# EAGLE design MoleGraph_shield-v1 (EAGLE 4.15)
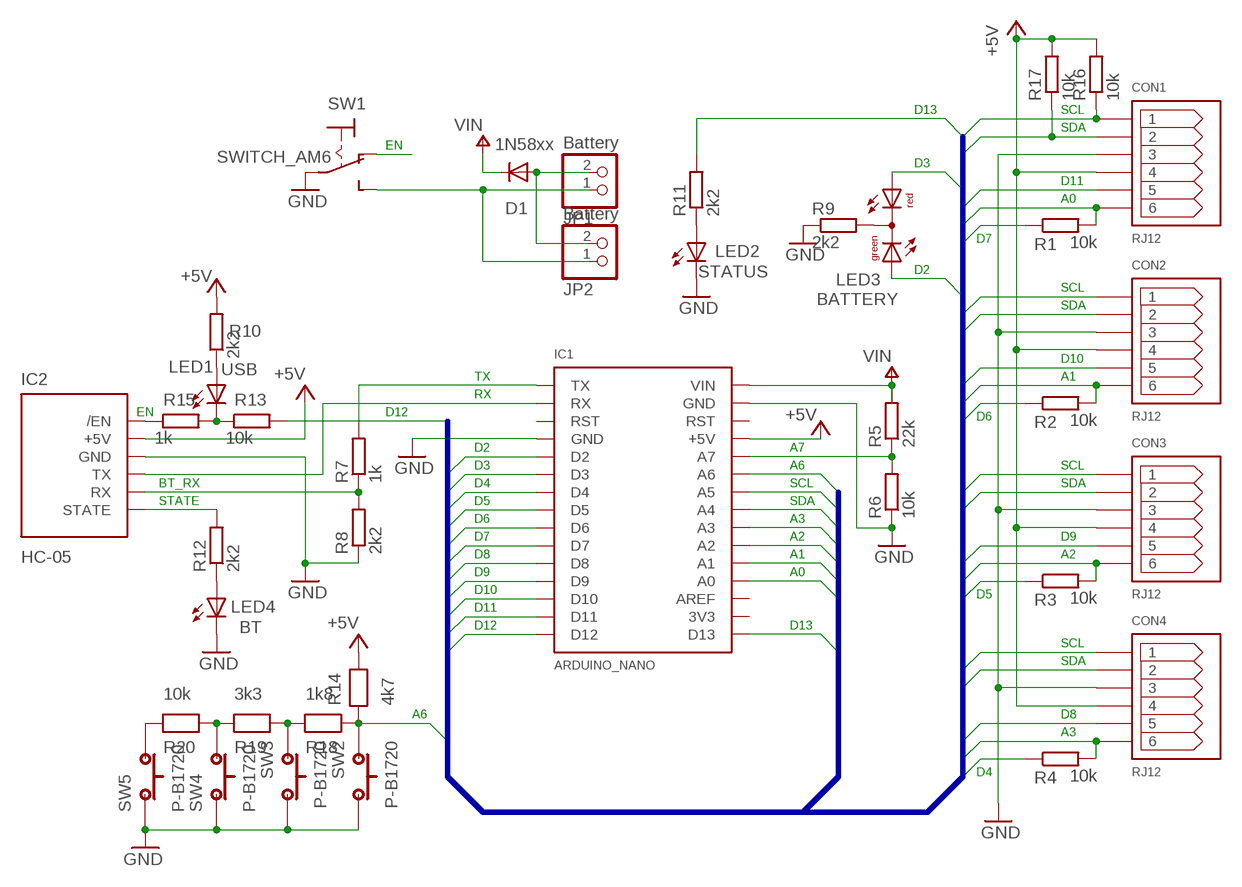
[diagram p0: schematic, sheet 1]

## Parts
CON1  RJ12  [RJ12]
CON2  RJ12  [RJ12]
CON3  RJ12  [RJ12]
CON4  RJ12  [RJ12]
D1  1N58xx  1N4004  [DO41-10]
IC1  ARDUINO_NANO  [ARDUINO_NANO]
IC2  HC-05  [HC-05]
JP1  Battery  PINHD-1X2  [1X02]
JP2  Battery  PINHD-1X2  [1X02]
LED1  USB  LED3MM  [LED3MM]
LED2  STATUS  LED3MM  [LED3MM]
LED3  BATTERY  DUOLED3MM  [DUOLED3MM]
LED4  BT  LED3MM  [LED3MM]
R1  10k  R-EU_R1206  [R1206]
R2  10k  R-EU_R1206  [R1206]
R3  10k  R-EU_R1206  [R1206]
R4  10k  R-EU_R1206  [R1206]
R5  22k  R-EU_R1206  [R1206]
R6  10k  R-EU_R1206  [R1206]
R7  1k  R-EU_R1206  [R1206]
R8  2k2  R-EU_R1206  [R1206]
R9  2k2  R-EU_R1206  [R1206]
R10  2k2  R-EU_R1206  [R1206]
R11  2k2  R-EU_R1206  [R1206]
R12  2k2  R-EU_R1206  [R1206]
R13  10k  R-EU_R1206  [R1206]
R14  4k7  RESEU-7,5  [1206]
R15  1k  R-EU_R1206  [R1206]
R16  10k  R-EU_R1206  [R1206]
R17  10k  R-EU_R1206  [R1206]
R18  1k8  RESEU-7,5  [1206]
R19  3k3  RESEU-7,5  [1206]
R20  10k  RESEU-7,5  [1206]
SW1  SWITCH_AM6  [AM6]
SW2  P-B1720  [P-B1720]
SW3  P-B1720  [P-B1720]
SW4  P-B1720  [P-B1720]
SW5  P-B1720  [P-B1720]

## Nets
+5V: CON1.P$4 CON2.P$4 CON3.P$4 CON4.P$4 IC1.P$27(+5V) IC2.P$5(+5V) R10.2 R14.2 R16.2 R17.2
A0: CON1.P$6 IC1.P$19(A0) R1.2
A1: CON2.P$6 IC1.P$20(A1) R2.2
A2: CON3.P$6 IC1.P$21(A2) R3.2
A3: CON4.P$6 IC1.P$22(A3) R4.2
A6: IC1.P$25(A6) R14.1 R18.2 SW2.1
A7: IC1.P$26(A7) R5.1 R6.2
BT_RX: IC2.P$2(RX) R7.1 R8.2
D2: IC1.P$5(D2) LED3.AG
D3: IC1.P$6(D3) LED3.AR
D4: IC1.P$7(D4) R4.1
D5: IC1.P$8(D5) R3.1
D6: IC1.P$9(D6) R2.1
D7: IC1.P$10(D7) R1.1
D8: CON4.P$5 IC1.P$11(D8)
D9: CON3.P$5 IC1.P$12(D9)
D10: CON2.P$5 IC1.P$13(D10)
D11: CON1.P$5 IC1.P$14(D11)
D12: IC1.P$15(D12) R13.2
D13: IC1.P$16(D13) R11.2
EN: LED1.K(C) R13.1 R15.2 SW1.P$3(O)
GND: CON1.P$3 CON2.P$3 CON3.P$3 CON4.P$3 IC1.P$4(GND) IC1.P$29(GND) IC2.P$4(GND) LED2.K(C) LED4.K(C) R6.1 R8.1 R9.1 SW1.P$2(P) SW2.3 SW3.3 SW4.1 SW5.1
N$2: JP1.1 JP2.1 SW1.P$1(S)
N$3: D1.A JP1.2 JP2.2
N$6: LED3.K(C) R9.2
N$7: LED1.A R10.1
N$8: LED2.A R11.1
N$9: LED4.A R12.1
N$12: R18.1 R19.2 SW3.1
N$13: R19.1 R20.2 SW4.3
N$14: R20.1 SW5.3
N$15: IC2.P$6(/EN) R15.1
RX: IC1.P$2(RX) IC2.P$3(TX)
SCL: CON1.P$1 CON2.P$1 CON3.P$1 CON4.P$1 IC1.P$24(A5) R16.1
SDA: CON1.P$2 CON2.P$2 CON3.P$2 CON4.P$2 IC1.P$23(A4) R17.1
STATE: IC2.P$1(STATE) R12.2
TX: IC1.P$1(TX) R7.2
VIN: D1.C IC1.P$30(VIN) R5.2
Unconnected: IC1.P$3(RST) IC1.P$17(3V3) IC1.P$18(AREF) IC1.P$28(RST)

## Buses
SCL,SDA,D[0..13],A[0..3],A[6..7]

## Library data of the parts
CON1-CON4 = 1:RJ12
D1 = diode:1N4004: DIODE general purpose rectifier, 1 A
IC1 = 1:ARDUINO_NANO
IC2 = 1:HC-05
JP1 JP2 = pinhead:PINHD-1X2: PIN HEADER
LED1 LED2 LED4 = led:LED: LED OSRAM: - CHIPLED LG R971, LG N971, LY N971, LG Q971, LY Q971, LO R971, LY R971 LH N974, LH R974 LS Q976, LO Q976, LY Q976 LO Q996 - Hyper CHIPLED LW Q18S LB Q993, LB Q99A, LB R99A - SideLED LS A670, LO A670, LY A670, LG A670, LP A670 LB A673, LV A673, LT A673, LW A673 LH A674 LY A675 LS A676, LA A676, LO A676, LY A676, LW A676 LS A679, LY A679, LG A679 - Hyper Micro SIDELED® LS Y876, LA Y876, LO Y876, LY Y876 LT Y87S - SmartLED LW L88C, LW L88S LB L89C, LB L89S, LG L890 LS L89K, LO L89K, LY L89K LS L896, LA L896, LO L896, LY L896 - TOPLED LS T670, LO T670, LY T670, LG T670, LP T670 LSG T670, LSP T670, LSY T670, LOP T670, LYG T670 LG T671, LOG T671, LSG T671 LB T673, LV T673, LT T673, LW T673 LH T674 LS T676, LA T676, LO T676, LY T676, LB T676, LH T676, LSB T676, LW T676 LB T67C, LV T67C, LT T67C, LS T67K, LO T67K, LY T67K, LW E67C LS E67B, LA E67B, LO E67B, LY E67B, LB E67C, LV E67C, LT E67C LW T67C LS T679, LY T679, LG T679 LS T770, LO T770, LY T770, LG T770, LP T770 LB T773, LV T773, LT T773, LW T773 LH T774 LS E675, LA E675, LY E675, LS T675 LS T776, LA T776, LO T776, LY T776, LB T776 LHGB T686 LT T68C, LB T68C - Hyper Mini TOPLED® LB M676 - Mini TOPLED Santana® LG M470 LS M47K, LO M47K, LY M47K Source: http://www.osram.convergy.de/
LED3 = led:DUOLED3MM
R1-R13 R15-R17 = rcl:R-EU_: RESISTOR, European symbol
R14 R18-R20 = DISCRETE:RESEU-7,5
SW1 = switch:SWITCH_AM6
SW2-SW5 = 3:P-B1720

## Board
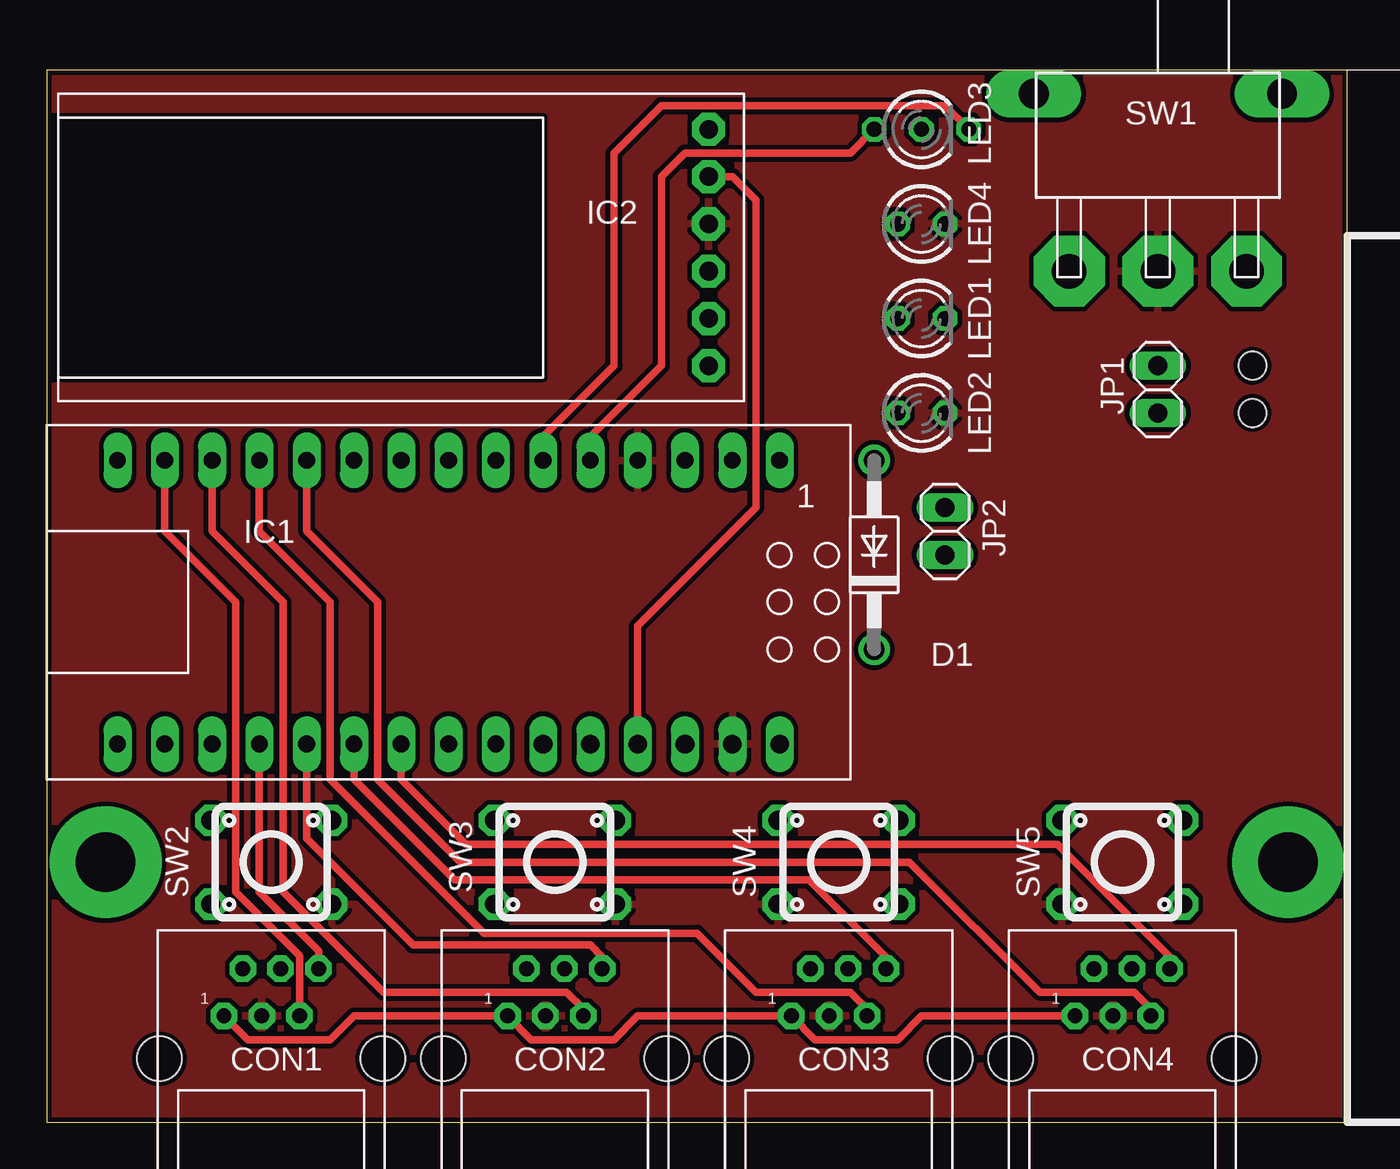
[diagram p1: board, top side]
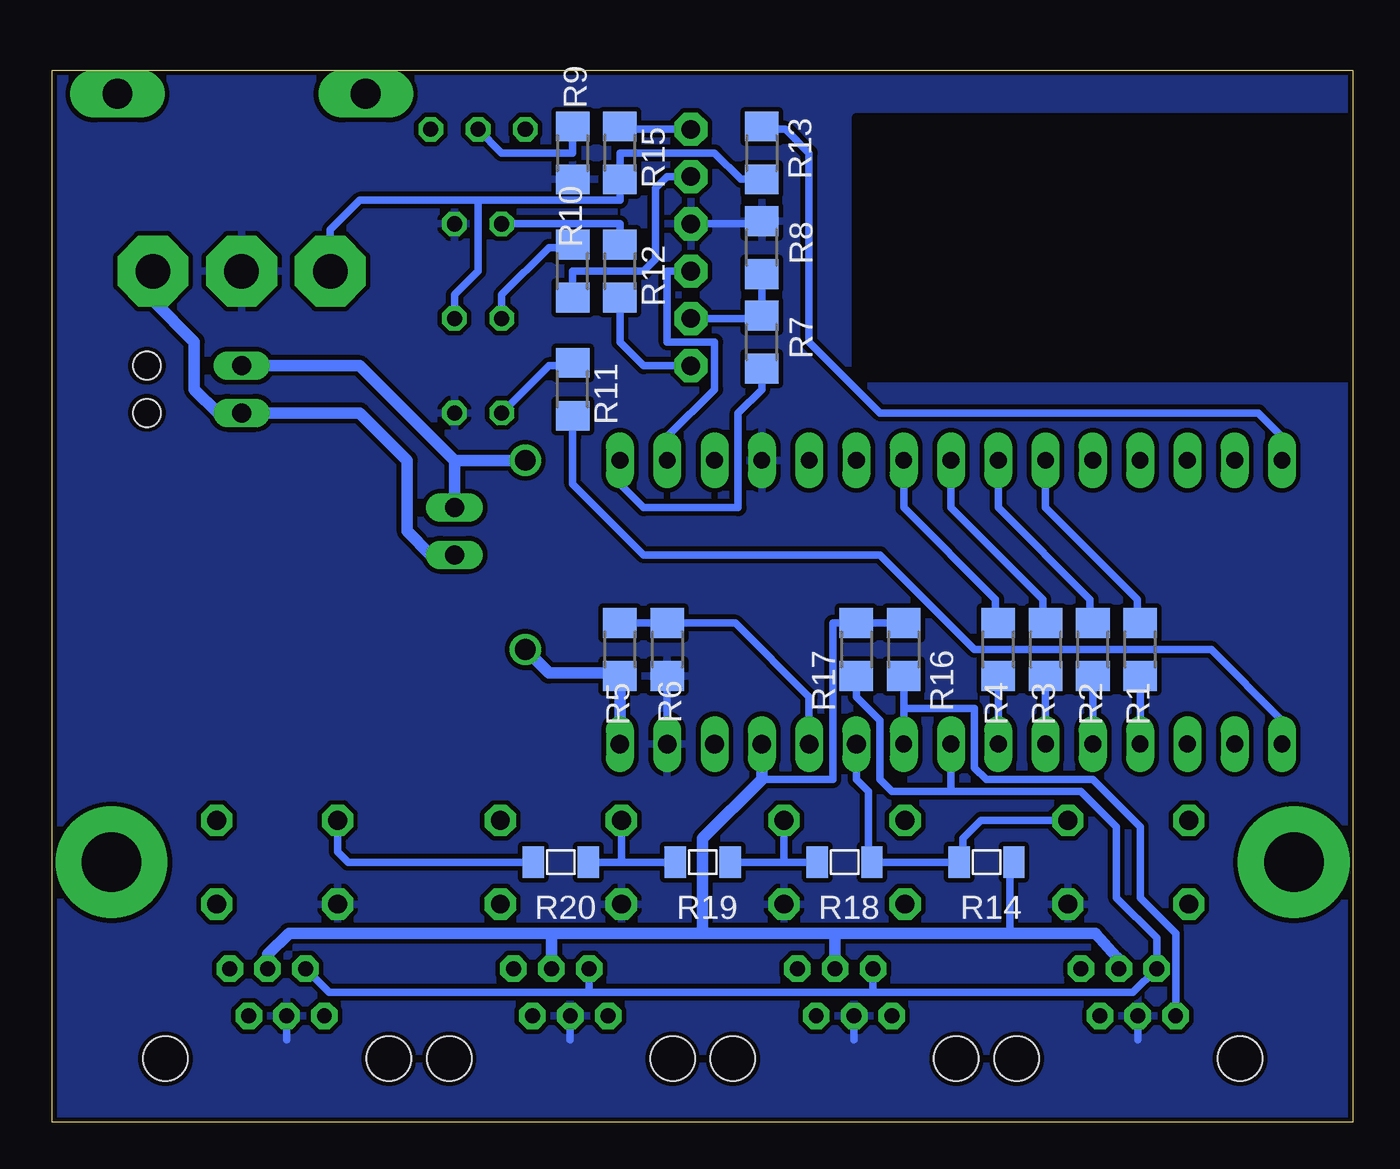
[diagram p2: board, bottom side, seen from below]

Size 69.85 x 56.52 mm. Coordinates in mm from the lower left corner, seen from the top.
Outline: 0,0 69.85,0 69.85,56.52 0,56.52 0,0
Copper layers (1*16): Top 0.035mm / dielectric 1.5mm / Bottom 0.035mm
Design rules "default": minimum track width 10mil, minimum drill 24mil, track to track 8mil, track to pad 8mil, pad to pad 8mil, via to via 8mil, smd to smd 8mil, copper to edge 10mil, drill to drill 8mil, minimum pad ring 10mil, minimum via ring 8mil, stop-mask expansion 4mil, vias tented up to drill 0mil, thermal gap 10mil
Holes 1.5 mm at 64.77,40.64 64.77,38.1
tRestrict: area 0.6,40 to 26.7,54
bRestrict: area 0.6,40 to 26.7,54

### Footprints (pad centres in the part's own frame; a part is rotated, then mirrored left to right if it is on the bottom)
RJ12 = drill 0.8 pad 1.422 octagon: P$1 -2.54,0; P$2 -1.524,2.54; P$3 -0.508,0; P$4 0.508,2.54; P$5 1.524,0; P$6 2.54,2.54 | hole 2.4: -6,-2.3; 6,-2.3
DO41-10 = drill 1.118 round: A 5.08,0; C -5.08,0
ARDUINO_NANO = drill 0.9 pad 1.5 long: P$1 -17.78,-7.62; P$2 -15.24,-7.62; P$3 -12.7,-7.62; P$4 -10.16,-7.62; P$5 -7.62,-7.62; P$6 -5.08,-7.62; P$7 -2.54,-7.62; P$8 0,-7.62; P$9 2.54,-7.62; P$10 5.08,-7.62; P$11 7.62,-7.62; P$12 10.16,-7.62; P$13 12.7,-7.62; P$14 15.24,-7.62; P$15 17.78,-7.62; P$16 17.78,7.62; P$17 15.24,7.62; P$18 12.7,7.62; P$19 10.16,7.62; P$20 7.62,7.62; P$21 5.08,7.62; P$22 2.54,7.62; P$23 0,7.62; P$24 -2.54,7.62 | drill 1 long: P$25 -5.08,7.62; P$26 -7.62,7.62; P$27 -10.16,7.62; P$28 -12.7,7.62; P$29 -15.24,7.62; P$30 -17.78,7.62
HC-05 = drill 1 pad 1.778 octagon: P$1 0,6.35; P$2 0,3.81; P$3 0,1.27; P$4 0,-1.27; P$5 0,-3.81; P$6 0,-6.35
1X02 = drill 1.016 long: 1 -1.27,0; 2 1.27,0
LED3MM = drill 0.813 octagon: A -1.27,0; K 1.27,0
DUOLED3MM = drill 0.813 octagon: AG -2.54,0; K 0,0 | drill 0.8 octagon: AR 2.54,0
R1206 = smd 1.6 x 1.803: 1 -1.422,0; 2 1.422,0
1206 = smd 1.143 x 1.702: 1 -1.473,0; 2 1.473,0
AM6 = drill 1.85 pad 3.81 octagon: P$1 -4.763,0; P$2 0,0; P$3 4.763,0 | drill 1.6 pad 2.54 long: P$4 -6.668,-9.525; P$5 6.668,-9.525
P-B1720 = drill 1.016 pad 1.676 octagon: 1 -2.25,3.25; 2 -2.25,-3.25; 3 2.25,3.25; 4 2.25,-3.25

### Placement (x,y rotation side)
CON1  12.06,5.71 0 top
CON2  27.3,5.71 0 top
CON3  42.55,5.71 0 top
CON4  57.78,5.71 0 top
D1  44.45,30.48 90 top
IC1  21.59,27.94 180 top
IC2  35.56,46.99 180 top
JP1  59.69,39.37 90 top
JP2  48.26,31.75 90 top
LED1  46.99,43.18 0 top
LED2  46.99,38.1 0 top
LED3  46.99,53.34 0 top
LED4  46.99,48.26 0 top
R1  11.43,25.4 270 bottom
R2  13.97,25.4 270 bottom
R3  16.51,25.4 270 bottom
R4  19.05,25.4 270 bottom
R5  39.37,25.4 270 bottom
R6  36.83,25.4 90 bottom
R7  31.75,41.91 270 bottom
R8  31.75,46.99 270 bottom
R9  41.91,52.07 90 bottom
R10  41.91,45.72 270 bottom
R11  41.91,39.37 270 bottom
R12  39.37,45.72 270 bottom
R13  31.75,52.07 90 bottom
R14  19.68,13.97 0 bottom
R15  39.37,52.07 270 bottom
R16  24.13,25.4 90 bottom
R17  26.67,25.4 90 bottom
R18  27.3,13.97 0 bottom
R19  34.92,13.97 0 bottom
R20  42.55,13.97 0 bottom
SW1  59.69,45.72 180 top
SW2  12.06,13.97 270 top
SW3  27.3,13.97 270 top
SW4  42.55,13.97 90 top
SW5  57.78,13.97 90 top

### Tracks (layer width: path | path; a pad name or v marks a point on that pad's centre or on a via)
+5V
  Top 0.406: IC1.P$27 31.75,26.67 38.1,33.02 38.1,49.53 36.83,50.8 IC2.P$5
  Bottom 0.406: IC2.P$5 36.83,50.8 37.47,50.16 37.47,46.35 38.1,45.72 41.91,45.72 R10.2 | 18.41,10.16 18.41,13.97 R14.2 | 31.75,18.41 27.94,18.41 27.94,26.82 R17.2 R16.2 24.13,26.67
  Bottom 0.61: CON1.P$4 12.57,8.76 12.7,8.89 13.84,10.16 18.41,10.16 27.81,10.16 | 27.81,10.16 CON2.P$4 | 27.81,10.16 34.92,10.16 | 34.92,10.16 43.05,10.16 | 43.05,10.16 CON3.P$4 | 34.92,10.16 34.92,15.24 31.75,18.41 IC1.P$27 | 43.05,10.16 57.15,10.16 58.29,9.02 CON4.P$4
A0
  Top 0.406: CON1.P$6 14.61,9.21 11.43,12.38 IC1.P$19
  Bottom 0.406: 11.43,24.13 R1.2 IC1.P$19
A1
  Top 0.406: CON2.P$6 29.84,8.89 29.21,9.53 19.68,9.53 13.97,15.24 IC1.P$20
  Bottom 0.406: IC1.P$20 R2.2
A2
  Top 0.406: CON3.P$6 45.09,8.89 40.96,13.02 21.91,13.02 16.51,18.41 IC1.P$21
  Bottom 0.406: IC1.P$21 R3.2
A3
  Top 0.406: CON4.P$6 60.33,8.89 54.29,14.92 22.54,14.92 19.05,18.41 IC1.P$22
  Bottom 0.406: IC1.P$22 R4.2
A6
  Bottom 0.406: IC1.P$25 26.67,18.41 26.04,17.78 26.04,13.97 R18.2 R14.1 20.95,13.97 20.95,15.24 20.32,15.88 19.98,16.22 SW2.1
A7
  Bottom 0.406: R5.1 36.98,26.82 36.83,26.67 R6.2 33.17,26.82 29.21,22.86 IC1.P$26
BT_RX
  Bottom 0.406: IC2.P$2 31.75,43.18 R7.1 R8.2 31.75,45.72
D2
  Top 0.406: IC1.P$5 29.21,36.83 33.02,40.64 33.02,50.8 34.29,52.07 43.18,52.07 LED3.AG
D3
  Top 0.406: IC1.P$6 26.67,36.83 30.48,40.64 30.48,52.07 33.02,54.61 48.26,54.61 LED3.AR
D4
  Bottom 0.406: R4.1 19.2,26.82 19.2,28.09 24.13,33.02 IC1.P$7
D5
  Bottom 0.406: R3.1 16.66,26.82 16.66,28.09 21.59,33.02 IC1.P$8
D6
  Bottom 0.406: R2.1 14.12,26.82 14.12,28.09 19.05,33.02 IC1.P$9
D7
  Bottom 0.406: R1.1 11.58,26.82 11.58,28.09 16.51,33.02 IC1.P$10
D8
  Top 0.406: IC1.P$11 13.97,31.75 17.78,27.94 17.78,18.41 22.23,13.97 46.35,13.97 53.34,6.99 58.42,6.99 59.31,6.1 CON4.P$5
D9
  Top 0.406: IC1.P$12 11.43,31.75 15.24,27.94 15.24,18.41 23.5,10.16 34.92,10.16 38.1,6.99 43.18,6.99 44.07,6.1 CON3.P$5
D10
  Top 0.406: IC1.P$13 8.89,31.75 12.7,27.94 12.7,12.38 18.1,6.99 27.94,6.99 28.83,6.1 CON2.P$5
D11
  Top 0.406: CON1.P$5 13.59,8.95 10.16,12.38 10.16,27.94 6.35,31.75 IC1.P$14
D12
  Bottom 0.406: IC1.P$15 3.81,36.83 5.08,38.1 25.4,38.1 29.21,41.91 29.21,52.07 30.48,53.34 31.75,53.34 R13.2
D13
  Bottom 0.406: IC1.P$16 3.81,21.59 7.62,25.4 20.32,25.4 25.4,30.48 38.1,30.48 41.91,34.29 R11.2 41.91,36.83
EN
  Bottom 0.406: 46.99,49.53 39.37,49.53 R15.2 39.37,52.07 34.29,52.07 32.87,50.65 31.9,50.65 31.75,50.8 R13.1 | 46.99,49.53 46.99,45.72 48.26,44.45 LED1.K | 46.99,49.53 53.34,49.53 54.93,47.94 SW1.P$3
GND
  Bottom 0.406: 57.28,4.45 CON4.P$3 | 42.04,4.45 CON3.P$3 | 11.56,4.45 CON1.P$3 | 26.8,4.45 CON2.P$3 | IC1.P$29 R6.1 | R8.1 31.75,48.26 IC2.P$4
  pour Bottom (isolate 0.254): 0,0 69.85,0 69.85,56.52 0,56.52
  pour Top (isolate 0.254): 0,0 69.85,0 69.85,56.52 0,56.52
N$2
  Bottom 0.61: JP2.1 49.53,30.48 50.8,31.75 50.8,35.56 53.34,38.1 JP1.1 60.96,38.1 62.23,39.37 62.23,41.91 64.45,44.13 SW1.P$1
N$3
  Bottom 0.61: 48.26,35.56 53.34,40.64 JP1.2 | D1.A 48.26,35.56 | 48.26,35.56 JP2.2
N$6
  Bottom 0.406: LED3.K 45.72,52.07 41.91,52.07 R9.2
N$7
  Bottom 0.406: R10.1 41.91,46.99 43.18,46.99 45.72,44.45 LED1.A
N$8
  Bottom 0.406: R11.1 41.91,40.64 43.18,40.64 LED2.A
N$9
  Bottom 0.406: R12.1 39.37,48.26 LED4.A
N$10  (via drill 3.2 pad 6)
  other vias: 3.17,13.97
N$12
  Bottom 0.406: 33.66,13.97 R19.2 30.48,13.97 | R18.1 30.48,13.97 | SW3.1 30.55,14.04 30.48,13.97
N$13
  Bottom 0.406: R19.1 39.37,13.97 | 39.37,13.97 R20.2 | SW4.3 39.3,14.04 39.37,13.97
N$14
  Bottom 0.406: SW5.3 54.53,14.53 53.98,13.97 R20.1 51.44,13.97
N$15
  Bottom 0.406: R15.1 39.37,53.34 IC2.P$6
N$17  (via drill 3.2 pad 6)
  other vias: 66.67,13.97
RX
  Bottom 0.406: IC1.P$2 36.83,36.83 34.29,39.37 34.29,41.91 36.83,41.91 36.83,45.72 IC2.P$3
SCL
  Top 0.406: CON1.P$1 10.79,4.45 15.24,4.45 16.51,5.71 CON2.P$1 26.04,4.45 30.48,4.45 31.75,5.71 CON3.P$1 41.27,4.45 45.72,4.45 46.99,5.71 CON4.P$1
  Bottom 0.406: 24.13,22.23 IC1.P$24 | 24.13,22.23 20.32,22.23 20.32,19.05 19.68,18.41 13.97,18.41 11.43,15.88 11.43,12.06 9.53,10.16 CON1.P$1 | 24.13,24.13 R16.1 24.13,22.23
SDA
  Bottom 0.406: 25.78,6.99 11.81,6.99 CON1.P$2 10.54,9.91 12.7,12.06 12.7,15.88 14.61,17.78 21.59,17.78 | 25.78,6.99 CON2.P$2 | 25.78,6.99 41.02,6.99 | 41.02,6.99 CON3.P$2 | CON4.P$2 54.99,6.99 41.02,6.99 | 21.59,17.78 IC1.P$23 | R17.1 26.67,22.86 25.4,21.59 25.4,18.41 24.77,17.78 21.59,17.78
STATE
  Bottom 0.406: IC2.P$1 38.1,40.64 39.37,41.91 R12.2 39.37,44.45
TX
  Bottom 0.406: IC1.P$1 39.37,34.29 38.1,33.02 33.02,33.02 33.02,38.1 31.75,39.37 R7.2 31.75,40.64
VIN
  Bottom 0.406: R5.2 39.37,24.13
  Bottom 0.61: IC1.P$30 R5.2 | D1.C 43.18,24.13 39.37,24.13

### Text on the board
tPlace: Battery | 9V
Document: Bluetooth HC-05 | Arduino Nano
mybDoc: www.e-mole.cz | MoleGraph shield